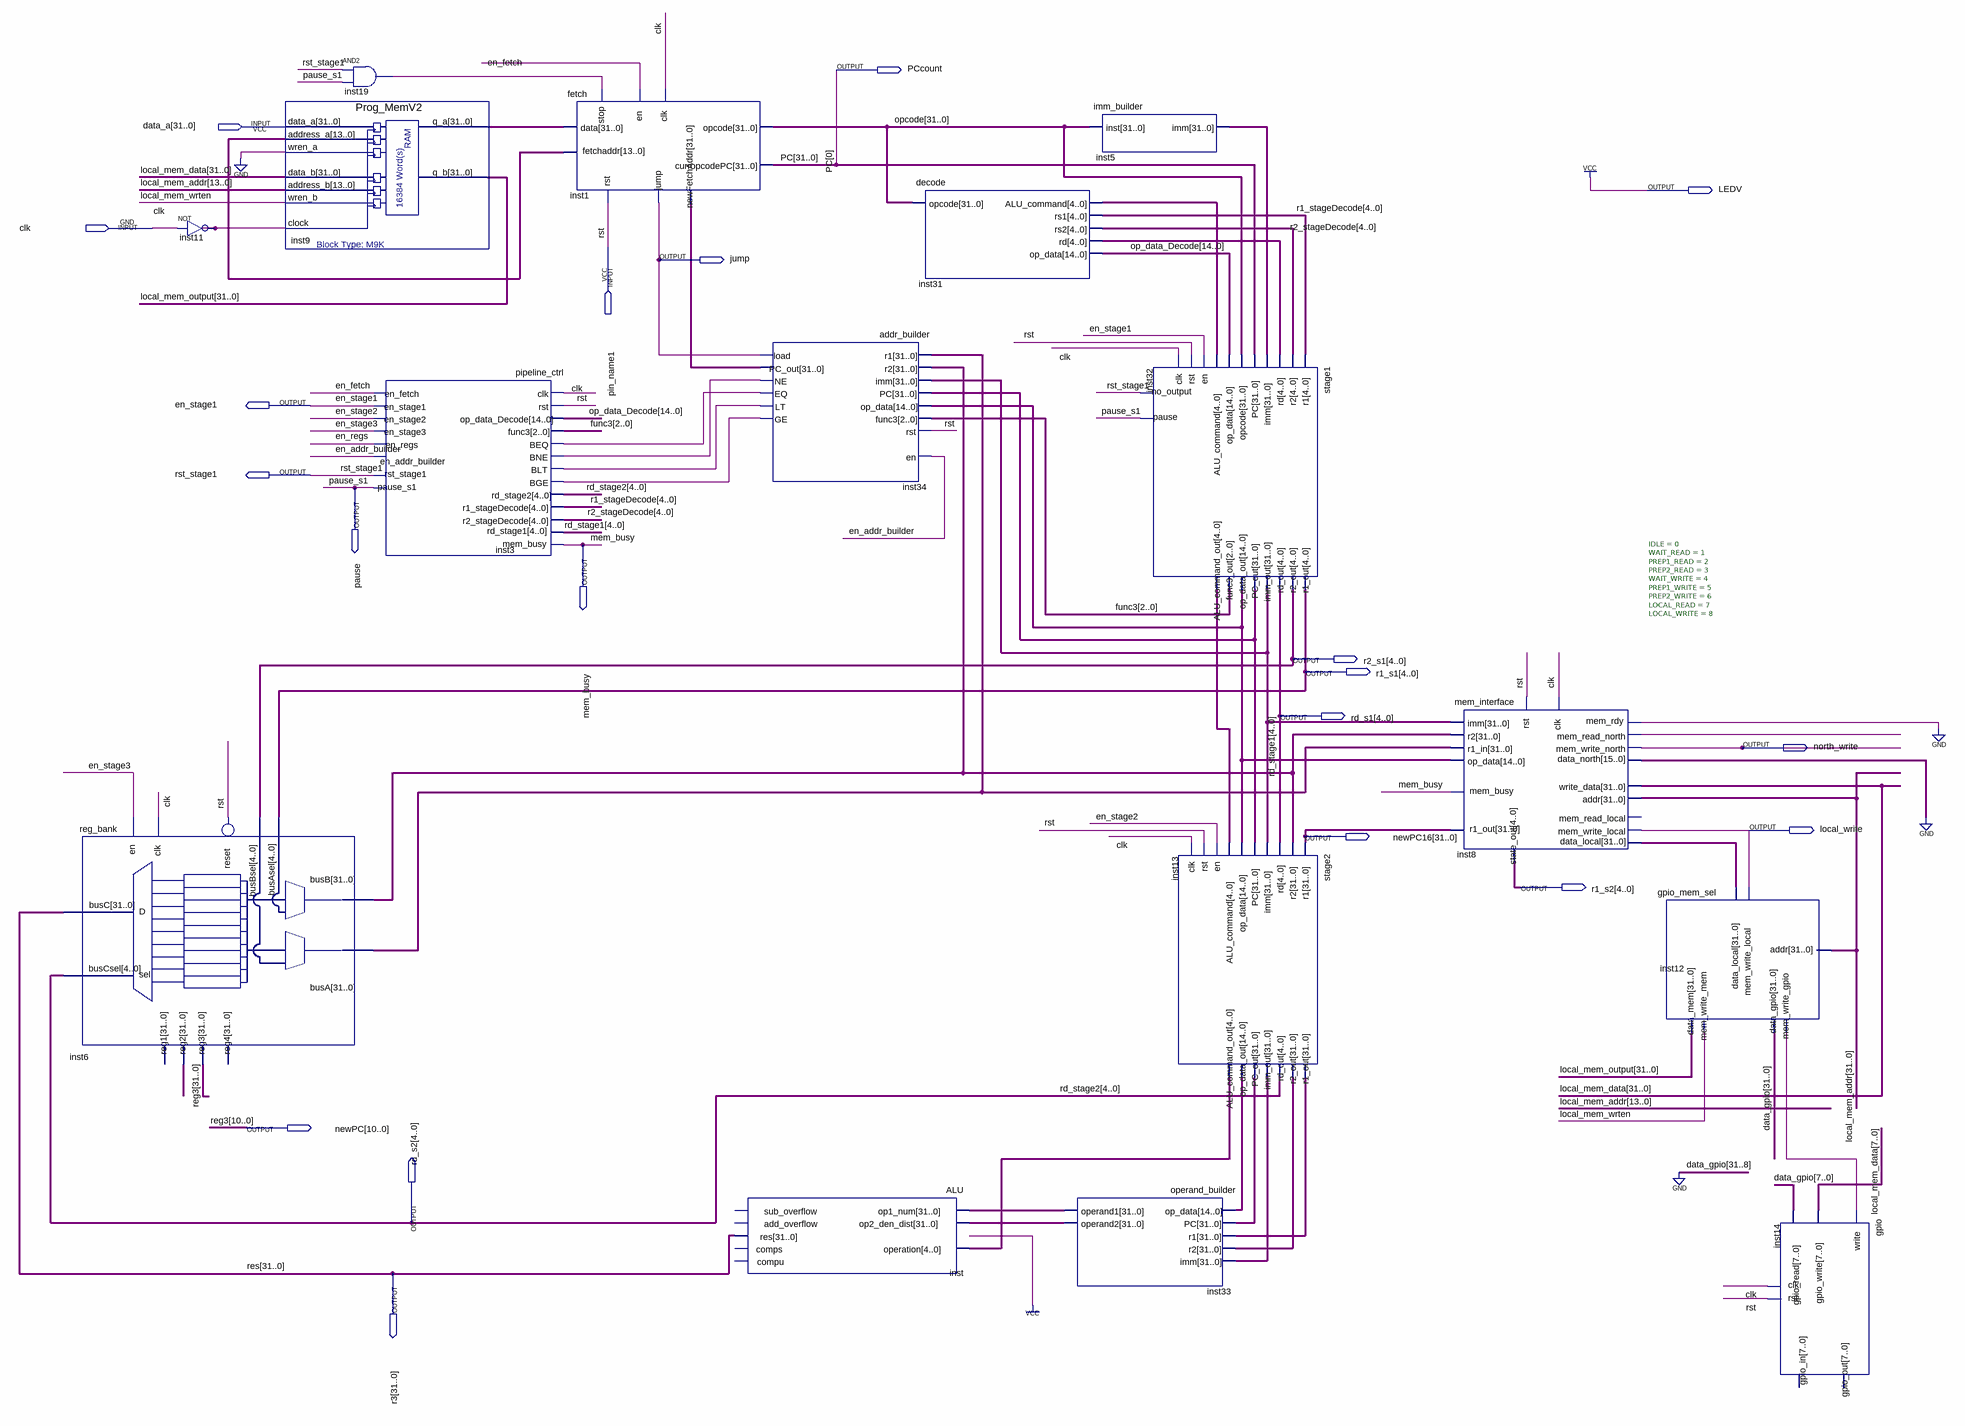
[diagram p0: schematic sheet]
// Quartus schematic RISCV_CPU.bdf as structural Verilog: 16 symbols, 20 pins
module RISCV_CPU (
  input  [31:0] data_a,
  input  clk,
  input  pin_name1,
  output PCcount,
  output LEDV,
  output jump,
  output en_stage1,
  output rst_stage1,
  output pause,
  output mem_busy,
  output [4:0] r2_s1,
  output [4:0] r1_s1,
  output [4:0] rd_s1,
  output north_write,
  output local_write,
  output [31:0] newPC16,
  output [4:0] r1_s2,
  output [10:0] newPC,
  output [4:0] rd_s2,
  output [31:0] r3
);

  wire en_addr_builder, en_fetch, en_regs, en_stage2, en_stage3, inst8_mem_read_north, inst11_out,
       inst12_mem_write_gpio, inst19_out, inst34_eq, inst34_ge, inst34_lt, inst34_ne, local_mem_wrten;
  wire [2:0] func3;
  wire [4:0] inst13_alu_command_out, inst31_alu_command, inst31_rd, inst32_alu_command_out, r1_stageDecode,
       r2_stageDecode;
  wire [7:0] data_gpio;
  wire [13:0] inst1_fetchaddr;
  wire [14:0] inst13_op_data_out, inst32_op_data_out, op_data_Decode;
  wire [31:0] inst5_imm, inst6_busa, inst6_busb, inst6_reg2, inst9_q_a, inst12_data_local, inst13_imm_out,
       inst13_pc_out, inst13_r1_out, inst13_r2_out, inst32_imm_out, inst32_pc_out, inst33_operand1,
       inst33_operand2, inst34_pc_out, local_mem_addr, local_mem_data, local_mem_output, opcode;
  wire [31:1] PC;
  wire [31:11] reg3;

  reg_bank inst6 (
    .busAsel(r1_s1), .busBsel(r2_s1), .busC(r3), .busCsel(rd_s2), .reset(pin_name1), .clk(clk),
    .en(en_stage3), .busA(inst6_busa), .busB(inst6_busb), .reg2(inst6_reg2), .reg3({reg3, newPC}));  // open: reg1, reg4
  not inst11 (inst11_out, clk);
  Prog_MemV2 inst9 (
    .data_a(data_a), .address_a(inst1_fetchaddr), .wren_a(1'b0), .data_b(local_mem_data),
    .address_b(local_mem_addr[13:0]), .wren_b(local_mem_wrten), .clock(inst11_out), .q_a(inst9_q_a),
    .q_b(local_mem_output));
  and inst19 (inst19_out, rst_stage1, pause);
  pipeline_ctrl inst3 (
    .clk(clk), .rst(pin_name1), .op_data_Decode(op_data_Decode), .func3(func3), .BEQ(inst34_eq),
    .BNE(inst34_ne), .BLT(inst34_lt), .BGE(inst34_ge), .rd_stage2(rd_s2), .r1_stageDecode(r1_stageDecode),
    .r2_stageDecode(r2_stageDecode), .rd_stage1(rd_s1), .mem_busy(mem_busy), .en_fetch(en_fetch),
    .en_stage1(en_stage1), .en_stage2(en_stage2), .en_stage3(en_stage3), .en_regs(en_regs),
    .en_addr_builder(en_addr_builder), .rst_stage1(rst_stage1), .pause_s1(pause));
  fetch inst1 (
    .clk(clk), .newFetchAddr(inst34_pc_out), .jump(jump), .data(inst9_q_a), .en(en_fetch), .rst(pin_name1),
    .stop(inst19_out), .fetchaddr(inst1_fetchaddr), .curropcodePC({PC, PCcount}), .opcode(opcode));
  ALU inst (
    .op1_num(inst33_operand1), .op2_den_dist(inst33_operand2), .operation(inst13_alu_command_out), .res(r3));  // open: sub_overflow, add_overflow, comps, compu
  addr_builder inst34 (
    .r1(inst6_busa), .r2(inst6_busb), .imm(inst32_imm_out), .PC(inst32_pc_out), .op_data(inst32_op_data_out),
    .func3(func3), .rst(pin_name1), .en(en_addr_builder), .load(jump), .PC_out(inst34_pc_out),
    .NE(inst34_ne), .EQ(inst34_eq), .LT(inst34_lt), .GE(inst34_ge));
  decode inst31 (
    .opcode(opcode), .ALU_command(inst31_alu_command), .rs1(r1_stageDecode), .rs2(r2_stageDecode),
    .rd(inst31_rd), .op_data(op_data_Decode));
  imm_builder inst5 (.inst(opcode), .imm(inst5_imm));
  operand_builder inst33 (
    .op_data(inst13_op_data_out), .PC(inst13_pc_out), .r1(inst13_r1_out), .r2(inst13_r2_out),
    .imm(inst13_imm_out), .operand1(inst33_operand1), .operand2(inst33_operand2));
  stage1 inst32 (
    .r1(r1_stageDecode), .r2(r2_stageDecode), .rd(inst31_rd), .imm(inst5_imm), .PC({PC, PCcount}),
    .opcode(opcode), .op_data(op_data_Decode), .ALU_command(inst31_alu_command), .en(en_stage1),
    .rst(pin_name1), .clk(clk), .no_output(rst_stage1), .pause(pause), .r1_out(r1_s1), .r2_out(r2_s1),
    .rd_out(rd_s1), .imm_out(inst32_imm_out), .PC_out(inst32_pc_out), .op_data_out(inst32_op_data_out),
    .func3_out(func3), .ALU_command_out(inst32_alu_command_out));
  stage2 inst13 (
    .r1(newPC16), .r2(inst6_busb), .rd(rd_s1), .imm(inst32_imm_out), .PC(inst32_pc_out),
    .op_data(inst32_op_data_out), .ALU_command(inst32_alu_command_out), .en(en_stage2), .rst(pin_name1),
    .clk(clk), .r1_out(inst13_r1_out), .r2_out(inst13_r2_out), .rd_out(rd_s2), .imm_out(inst13_imm_out),
    .PC_out(inst13_pc_out), .op_data_out(inst13_op_data_out), .ALU_command_out(inst13_alu_command_out));
  mem_interface #(.IDLE(0), .WAIT_READ(1), .PREP1_READ(2), .PREP2_READ(3), .WAIT_WRITE(4), .PREP1_WRITE(5), .PREP2_WRITE(6), .LOCAL_READ(7), .LOCAL_WRITE(8)) inst8 (
    .imm(inst32_imm_out), .r2(inst6_busb), .r1_in(inst6_busa), .op_data(inst32_op_data_out),
    .data_north({16{1'b0}}), .data_local(inst12_data_local), .mem_rdy(1'b0), .clk(clk), .rst(pin_name1),
    .r1_out(newPC16), .write_data(local_mem_data), .addr(local_mem_addr),
    .mem_read_north(inst8_mem_read_north), .mem_write_local(local_write), .mem_write_north(north_write),
    .mem_busy(mem_busy), .state_out(r1_s2));  // open: mem_read_local
  gpio_mem_sel inst12 (
    .addr(local_mem_addr), .mem_write_local(local_write), .data_gpio({{24{1'b0}}, data_gpio}),
    .data_mem(local_mem_output), .data_local(inst12_data_local), .mem_write_gpio(inst12_mem_write_gpio),
    .mem_write_mem(local_mem_wrten));
  gpio inst14 (
    .clk(clk), .rst(pin_name1), .gpio_write(local_mem_data[7:0]), .write(inst12_mem_write_gpio),
    .gpio_read(data_gpio));  // open: gpio_in, gpio_out

  assign LEDV = 1'b1;

  // Other names for the same wires on the sheet: pause_s1 = pause; PC[0] = PCcount; rd_stage1[4:0] = rd_s1;
  //   rd_stage2[4:0] = rd_s2; reg3[10:0] = newPC; res[31:0] = r3; rst = pin_name1
endmodule
